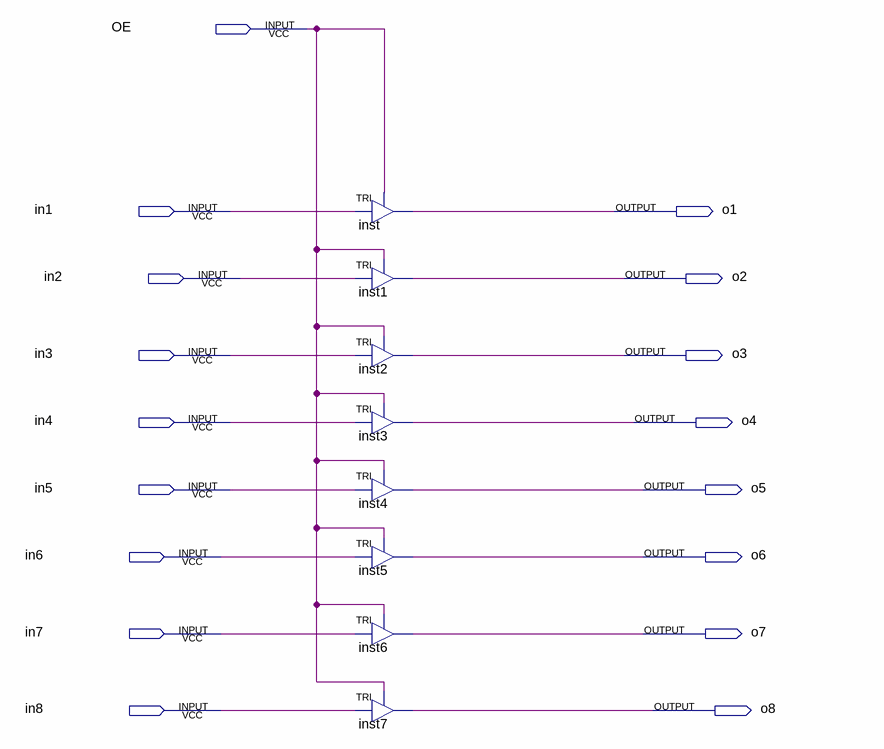
[diagram p0: schematic sheet]
// Quartus schematic 74125.bdf as structural Verilog: 8 symbols, 17 pins
module \74125  (
  input  OE,
  input  in1,
  input  in2,
  input  in3,
  input  in4,
  input  in5,
  input  in6,
  input  in7,
  input  in8,
  output o1,
  output o2,
  output o3,
  output o4,
  output o5,
  output o6,
  output o7,
  output o8
);

  TRI inst (.IN(in1), .OE(OE), .OUT(o1));
  TRI inst1 (.IN(in2), .OE(OE), .OUT(o2));
  TRI inst2 (.IN(in3), .OE(OE), .OUT(o3));
  TRI inst3 (.IN(in4), .OE(OE), .OUT(o4));
  TRI inst4 (.IN(in5), .OE(OE), .OUT(o5));
  TRI inst5 (.IN(in6), .OE(OE), .OUT(o6));
  TRI inst6 (.IN(in7), .OE(OE), .OUT(o7));
  TRI inst7 (.IN(in8), .OE(OE), .OUT(o8));
endmodule
